# EAGLE design openSX70-FTDI-232RL-Basic-5V_V4-1 (EAGLE 9.0.0)
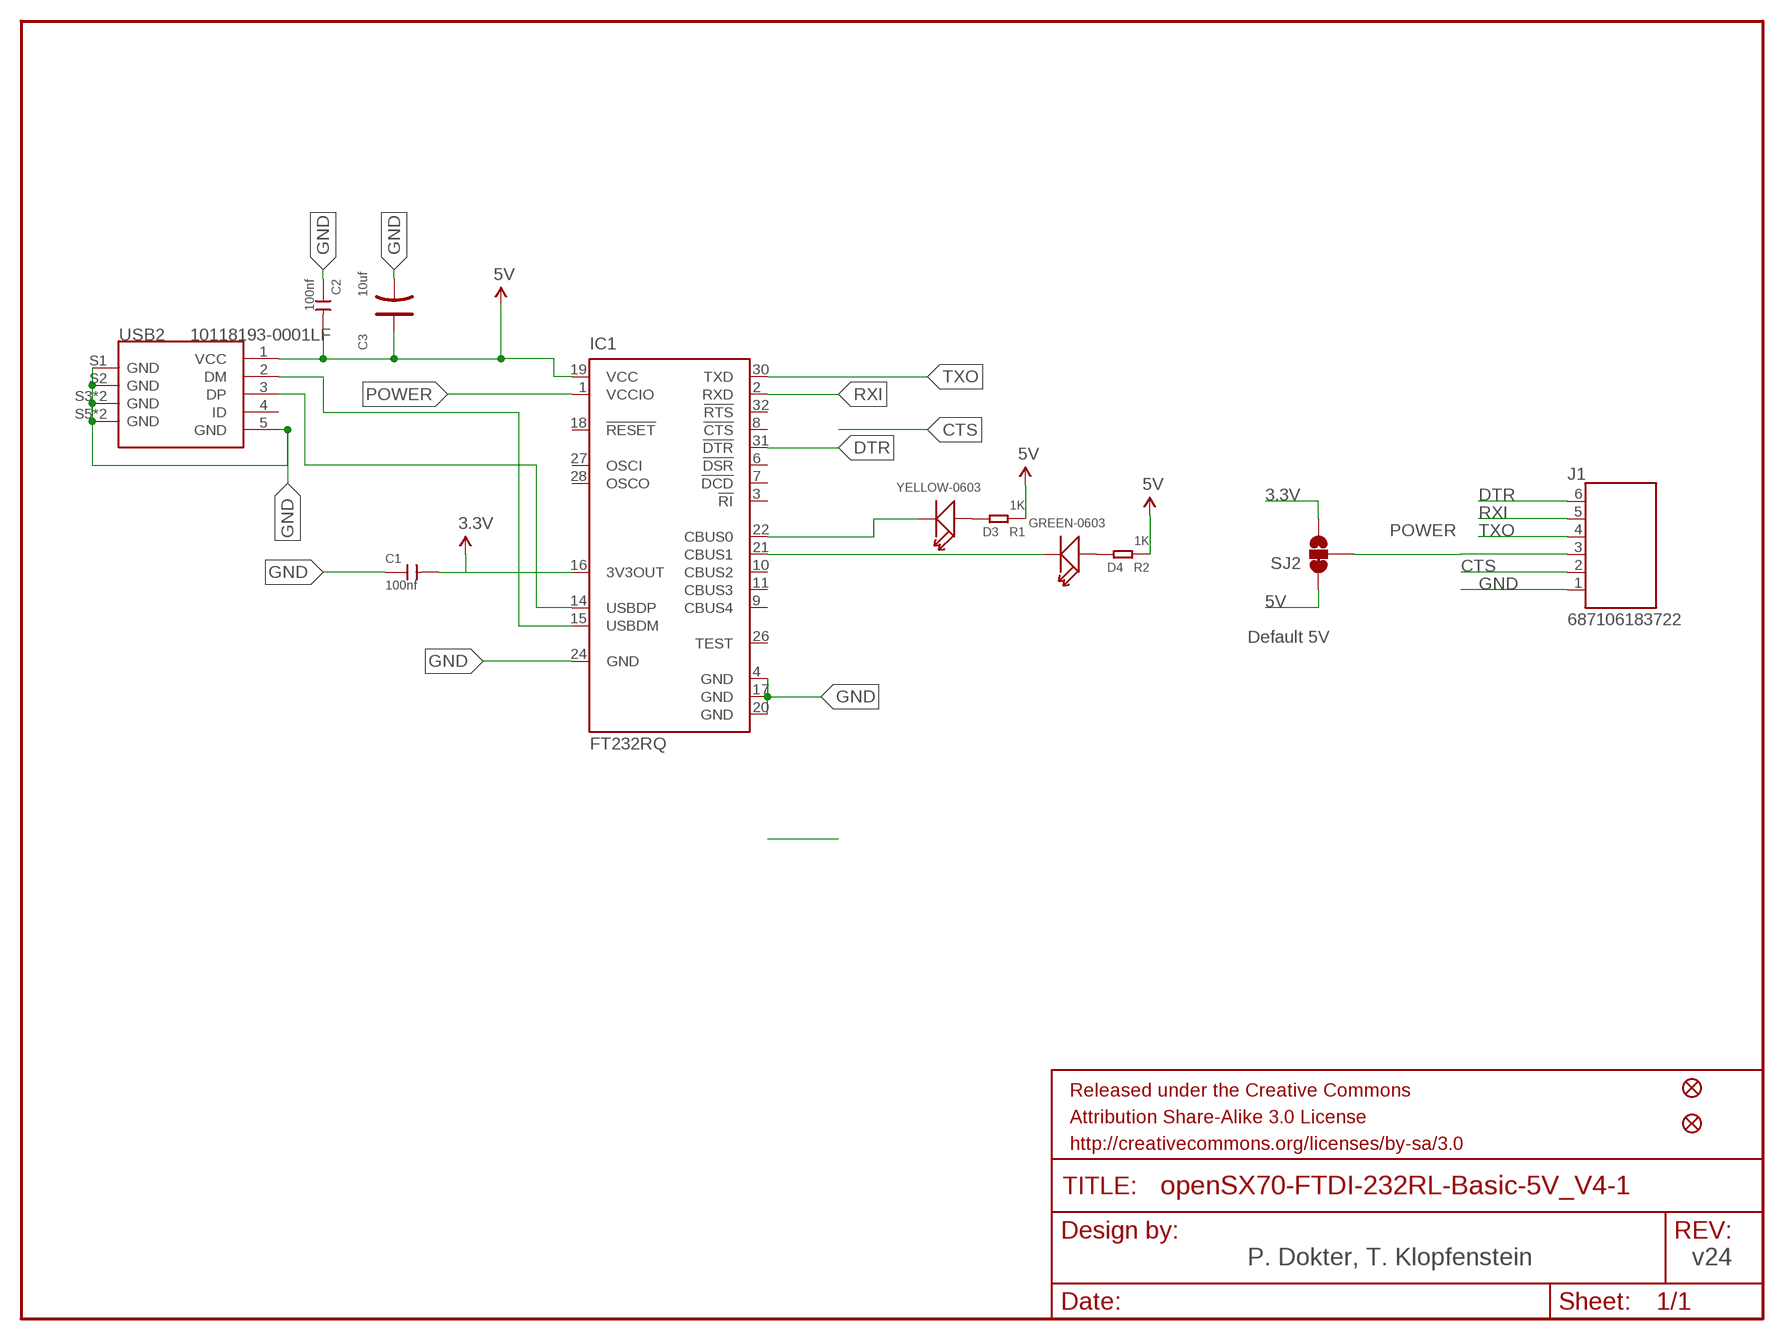
[diagram p0: schematic, sheet 1]

## Parts
C1  100nf  CERAMIC-100NF-50V-10%-X7R(0603)  [C0603]
C2  100nf  CERAMIC-100NF-50V-10%-X7R(0603)  [C0603]
C3  10uf  TANTALUM-SMD-10UF-16V-10%(AVX-A)  [AVX-A]
D3  YELLOW-0603  SMD-LED-CLEAR-YELLOW(0603)  [LED-0603]
D4  GREEN-0603  SMD-LED-CLEAR-GREEN(0603)  [LED-0603]
FRAME1  FRAME-LETTER  [CREATIVE_COMMONS]
IC1  FT232RQ  [QFN32]
J1  687106183722  [687106183722]
JP3  FIDUCIAL1X2  [FIDUCIAL-1X2]
JP5  FIDUCIAL1X2  [FIDUCIAL-1X2]
R1  1K  SMD-RES-1K-1%-1/10W(0603)  [R0603]
R2  1K  SMD-RES-1K-1%-1/10W(0603)  [R0603]
SJ2  SOLDERJUMPER_2WAYS  [SJ_3]
USB2  10118193-0001LF  MICRO-USB-SMD-B-(10118193-0001LF)  [MICRO-USB5+6P-SMD-0.65-B]

## Nets
3.3V [power]: SJ2.3
5V: C2.2 C3.+ IC1.19(VCC) R1.1 R2.1 SJ2.1 USB2.1(VCC)
CTS: IC1.8(!CTS) J1.2
DTR: IC1.31(!DTR) J1.6
GND [power]: C1.1 C2.1 C3.- IC1.4(GND) IC1.17(GND) IC1.20(GND) IC1.24(GND) J1.1 USB2.5(GND) USB2.S1(GND) USB2.S2(GND) USB2.S3(GND) USB2.S4(GND) USB2.S5(GND) USB2.S6(GND)
N$4: IC1.15(USBDM) USB2.2(DM)
N$6: IC1.14(USBDP) USB2.3(DP)
N$7: D3.- IC1.22(CBUS0)
N$8: D4.- IC1.21(CBUS1)
N$9: D3.+ R1.2
N$10: D4.+ R2.2
POWER: IC1.1(VCCIO) J1.3 SJ2.2
RXI: IC1.2(RXD) J1.5
TXO: IC1.30(TXD) J1.4
VCC: C1.2 IC1.16(3V3OUT) ; supply symbol labelled 3.3V
Unconnected: IC1.3(!RI) IC1.6(!DSR) IC1.7(!DCD) IC1.9(CBUS4) IC1.10(CBUS2) IC1.11(CBUS3) IC1.18(!RESET) IC1.26(TEST) IC1.27(OSCI) IC1.28(OSCO) IC1.32(!RTS) USB2.4(ID)

## Notes on the sheet
- Default 5V
- P. Dokter, T. Klopfenstein | v24

## Library data of the parts
C1 C2 = openSX70_PATHFINDER_V5.5-SEEED_20180522:CERAMIC-100NF-50V-10%-X7R(0603): 302010138; MPN: CC0603KRX7R9BB104
C3 = Seeed-Capacitor-2016:TANTALUM-SMD-10UF-16V-10%(AVX-A): 302020002; MPN: TAJA106K016RNJ
D3 = Seeed-LED-2016:SMD-LED-CLEAR-YELLOW(0603): 304090044; MPN: 19-217-Y5C-AM1N1VY-3T
D4 = Seeed-LED:SMD-LED-CLEAR-GREEN(0603): 304090043; MPN: 19-217-G7C-AN1P2-3T
FRAME1 = SparkFun-Aesthetics:FRAME-LETTER: Schematic Frame Standard 8.5x11 US Letter frame
IC1 = ftdichip:FT232R: Source: http://www.ftdichip.com/Documents/DataSheets/DS_FT232R_v104.pdf; MPN: FT232RQ; OC_FARNELL: 1146033; OC_NEWARK: 91K9919
J1 = openSX70_PATHFINDER_V5.5-SEEED_20180522:687106183722: 687106183722 WR-FPC 0.50mm SMT Horizontal Bottom Contact - Low Profile <http://katalog.we-online.de/media/images/v2/Family_WR-FPC_6871xx183722.jpg> Details see: http://katalog.we-online.de/en/em/FPC_0_5_SMT_ZIF_HORIZONTAL_BOTTOM_CONTACT_LOW_PROFILE_6871xx183722 Created by Yingchun,shan 2016 (C) Wurth Elektronik; AVAILABILITY: Good; DESCRIPTION: CONN FFC BTM 6POS 0.5MM SMD R/A; MF: Wurth Electronics; MP: 687106183722; PACKAGE: None; PRICE: 1.21 USD
JP3 JP5 = SparkFun:FIDUCIAL: Fiducial Alignment Points Various fiducial points for machine vision alignment.
R1 R2 = openSX70_PATHFINDER_V5.5-SEEED_20180522:SMD-RES-1K-1%-1/10W(0603): 301010298; MPN: RC0603FR-071KL
SJ2 = SparkFun:SOLDERJUMPER_2WAY: Solder Jumper 2 way solder jumper
USB2 = Seeed-Connector -2016:MICRO-USB-SMD-B-(10118193-0001LF): 320010003; MPN: 10118193-0001LF

## Net classes
0 default: width 0.203 mm
1 power: width 0.254 mm

## Board
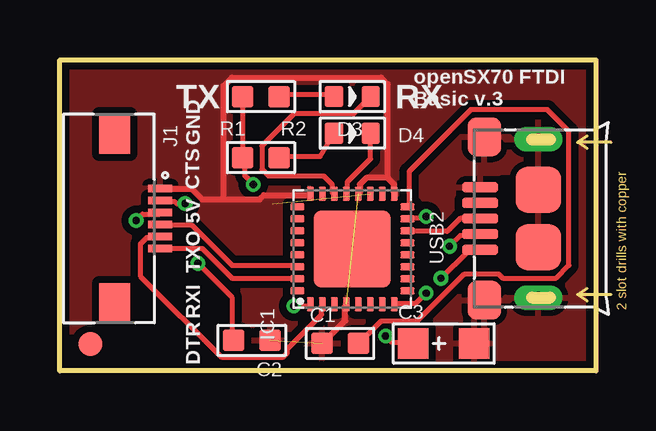
[diagram p1: board, top side]
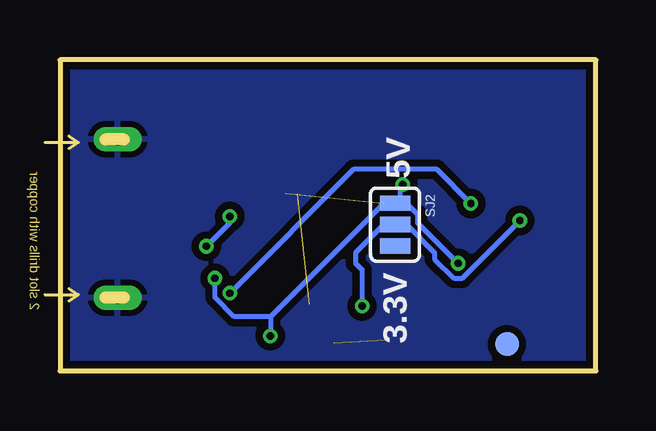
[diagram p2: board, bottom side, seen from below]

Size 22.35 x 12.95 mm. Coordinates in mm from the lower left corner, seen from the top.
Outline: 0,12.95 22.35,12.95 22.35,0 0,0 0,12.95
Copper layers (1*16): Top 0.035mm / dielectric 1.5mm / Bottom 0.035mm
Design rules "SeeedStudio_2layer_DRU_no_angle_20140221": minimum track width 6mil, minimum drill 12mil, track to track 6mil, track to pad 6mil, pad to pad 6mil, via to via 6mil, smd to smd 0mil, copper to edge 10mil, drill to drill 10mil, minimum pad ring 10mil, minimum via ring 6mil, stop-mask expansion 2mil, vias tented up to drill 100mil, thermal gap 10mil

### Footprints (pad centres in the part's own frame; a part is rotated, then mirrored left to right if it is on the bottom)
C0603 = smd 0.889 x 0.889: 1 0,0.762; 2 0,-0.762
AVX-A = smd 1.27 x 1.27: + -1.27,0; - 1.27,0
LED-0603 = smd 0.762 x 0.889: + -0.762,0; - 0.762,0
QFN32 = smd 0.6 x 0.3: 1 -2.3,1.75; 2 -2.3,1.25; 3 -2.3,0.75; 4 -2.3,0.25; 5 -2.3,-0.25; 6 -2.3,-0.75; 7 -2.3,-1.25; 8 -2.3,-1.75; 17 2.3,-1.75; 18 2.3,-1.25; 19 2.3,-0.75; 20 2.3,-0.25; 21 2.3,0.25; 22 2.3,0.75; 23 2.3,1.25; 24 2.3,1.75 | smd 0.3 x 0.6: 9 -1.75,-2.3; 10 -1.25,-2.3; 11 -0.75,-2.3; 12 -0.25,-2.3; 13 0.25,-2.3; 14 0.75,-2.3; 15 1.25,-2.3; 16 1.75,-2.3; 25 1.75,2.3; 26 1.25,2.3; 27 0.75,2.3; 28 0.25,2.3; 29 -0.25,2.3; 30 -0.75,2.3; 31 -1.25,2.3; 32 -1.75,2.3 | smd 3.2 x 3.2: EXP 0,0
687106183722 = smd 0.3 x 1: 1 -1.25,1.9; 2 -0.75,1.9; 3 -0.25,1.9; 4 0.25,1.9; 5 0.75,1.9; 6 1.25,1.9 | smd 1.65 x 1.3: Z1 -3.525,0; Z2 3.525,0
FIDUCIAL-1X2 = smd 1 x 1: 1 0,0
R0603 = smd 0.889 x 0.889: 1 0,0.762; 2 0,-0.762
SJ_3 = smd 0.635 x 1.27: 1 -0.889,0; 2 0,0; 3 0.889,0
MICRO-USB5+6P-SMD-0.65-B = smd 0.4 x 1.5: 1 -1.3,-0.25; 2 -0.65,-0.25; 3 0,-0.25; 4 0.65,-0.25; 5 1.3,-0.25 | smd 1.6 x 1.4: S1 -3.4,-0.427; S6 3.4,-0.427 | drill 0.508 pad 1.016 long: S2 -3.3,-2.675; S5 3.3,-2.675 | smd 1.9 x 1.9: S3 -1.2,-2.675; S4 1.2,-2.675

### Placement (x,y rotation side)
C1  11.68,1.14 90 top
C2  8,1.27 270 top
C3  16,1.14 0 top
D3  12.19,11.43 0 top
D4  12.19,9.91 0 top
FRAME1  -3.73,-3.81 0 top  (outside the outline)
IC1  12.19,5.08 90 top
J1  2.29,6.35 270 top
JP3  1.27,1.12 0 top
JP5  3.71,1.12 0 bottom
R1  8.38,11.43 90 top
R2  8.38,8.89 90 top
SJ2  8.38,6.1 270 bottom
USB2  17.27,6.35 90 top

### Tracks (layer width: path | path; a pad name or v marks a point on that pad's centre or on a via)
5V  (via drill 0.3)  (1 unrouted)
  Top 0.203: R1.1 R2.1 7.71,8.84 7.71,8.13 v8.06,7.77 | v5.75,4.48 7.17,3.06 7.17,1.28 C2.2 | v13.58,1.46 13.84,1.19 14.73,1.19 C3.+ | v15.89,3.86 17.04,5.02 17.49,5.02 USB2.1
  Bottom 0.203: v5.75,4.48 7.44,6.17 7.44,6.53 7.89,6.97 8.33,6.97 SJ2.1 | 13.58,2.26 v13.58,1.46 | 13.58,2.26 8.87,6.97 8.42,6.97 SJ2.1 | v15.89,3.86 15.89,3.06 15.09,2.26 13.58,2.26 | v8.06,7.77 8.15,7.68 8.15,7.06 SJ2.1
CTS  (via drill 0.3)
  Top 0.203: v15.27,3.24 14.82,2.79 14.02,2.79 IC1.8 | v5.22,6.97 4.86,6.97 4.77,7.06 4.24,7.06 J1.2
  Bottom 0.203: v15.27,3.24 10.11,8.39 6.64,8.39 v5.22,6.97
DTR
  Top 0.203: IC1.31 9.84,3.86 7.17,3.86 5.93,5.1 4.24,5.1 J1.6
GND  (2 unrouted)
  Top 0.254: 13.66,8.04 12.78,8.04 12.51,7.77 12.51,7.42 IC1.20 | 13.66,8.04 13.93,7.77 13.93,7.42 IC1.17 | 6.82,7.15 5.93,7.15 5.49,7.59 4.24,7.59 J1.1 | 6.82,7.15 8.33,7.15 8.51,7.33 10.38,7.33 IC1.24 | IC1.4 11.89,2.7 11.89,2.08 11,1.19 C1.1 | 13.66,8.04 13.66,11.95 13.4,12.22 7.17,12.22 6.82,11.86 6.82,7.15
  pour Bottom (isolate 0.305): 0.13,-0.03 0,12.86 22.22,12.86 22.35,-0.03
  pour Top (isolate 0.305): 0.13,-0.16 0.13,12.86 22.35,12.99 22.35,-0.03
N$4  (via drill 0.3)
  Top 0.203: v15.27,6.44 15.18,6.35 14.55,6.35 IC1.15 | v16.24,5.19 16.69,5.64 17.49,5.64 USB2.2
  Bottom 0.203: v15.27,6.44 15.27,6.17 v16.24,5.19
N$6
  Top 0.203: USB2.3 16.69,6.35 16.15,5.82 14.55,5.82 IC1.14
N$7
  Top 0.203: IC1.22 11.35,7.42 11.35,7.77 11,8.13 8.69,8.13 8.42,8.39 8.42,9.37 9.75,10.71 12.24,10.71 12.95,11.42 D3.-
N$8
  Top 0.203: IC1.21 11.98,7.42 11.98,7.86 12.95,8.84 D4.-
N$9
  Top 0.203: R1.2 9.22,11.51 11.35,11.51 D3.+
N$10
  Top 0.203: R2.2 9.22,8.93 10.85,8.93 D4.+
POWER  (via drill 0.3)
  Top 0.203: v9.75,2.7 10.38,2.7 IC1.1 | v3.17,6.26 3.44,6.53 4.15,6.53 J1.3
  Bottom 0.203: v9.75,2.7 9.75,4.22 10.02,4.48 10.02,4.93 8.87,6.08 8.42,6.08 SJ2.2 8.33,6.08 7.89,6.08 6.73,4.93 6.73,4.66 5.93,3.86 5.57,3.86 v3.17,6.26
RXI
  Top 0.203: IC1.2 10.91,2.7 10.91,2.35 9.49,0.93 9.49,0.75 9.31,0.57 6.73,0.57 3.35,3.95 3.35,5.28 3.62,5.55 4.15,5.55 J1.5
TXO
  Top 0.203: IC1.30 9.84,4.39 7.17,4.39 5.49,6.08 4.24,6.08 J1.4
VCC
  Top 0.203: IC1.16 14.55,6.88 14.55,8.31 17.13,10.88 20.33,10.88 21.22,9.99 21.22,4.39 20.69,3.86 18.47,3.86 18.29,4.04 16.87,4.04 14.91,2.08 13.4,2.08 12.51,1.19 C1.2

### Text on the board
tPlace: TX | RX | openSX70 FTDI / Basic v.3 | GND | CTS | 5V | TXO | RXI | DTR
bPlace: 5V | 3.3V
tValues: Close
Document: P. Dokter, T. Klopfenstein